# Altium schematic sheet ADC.SchDoc
size OrCAD A
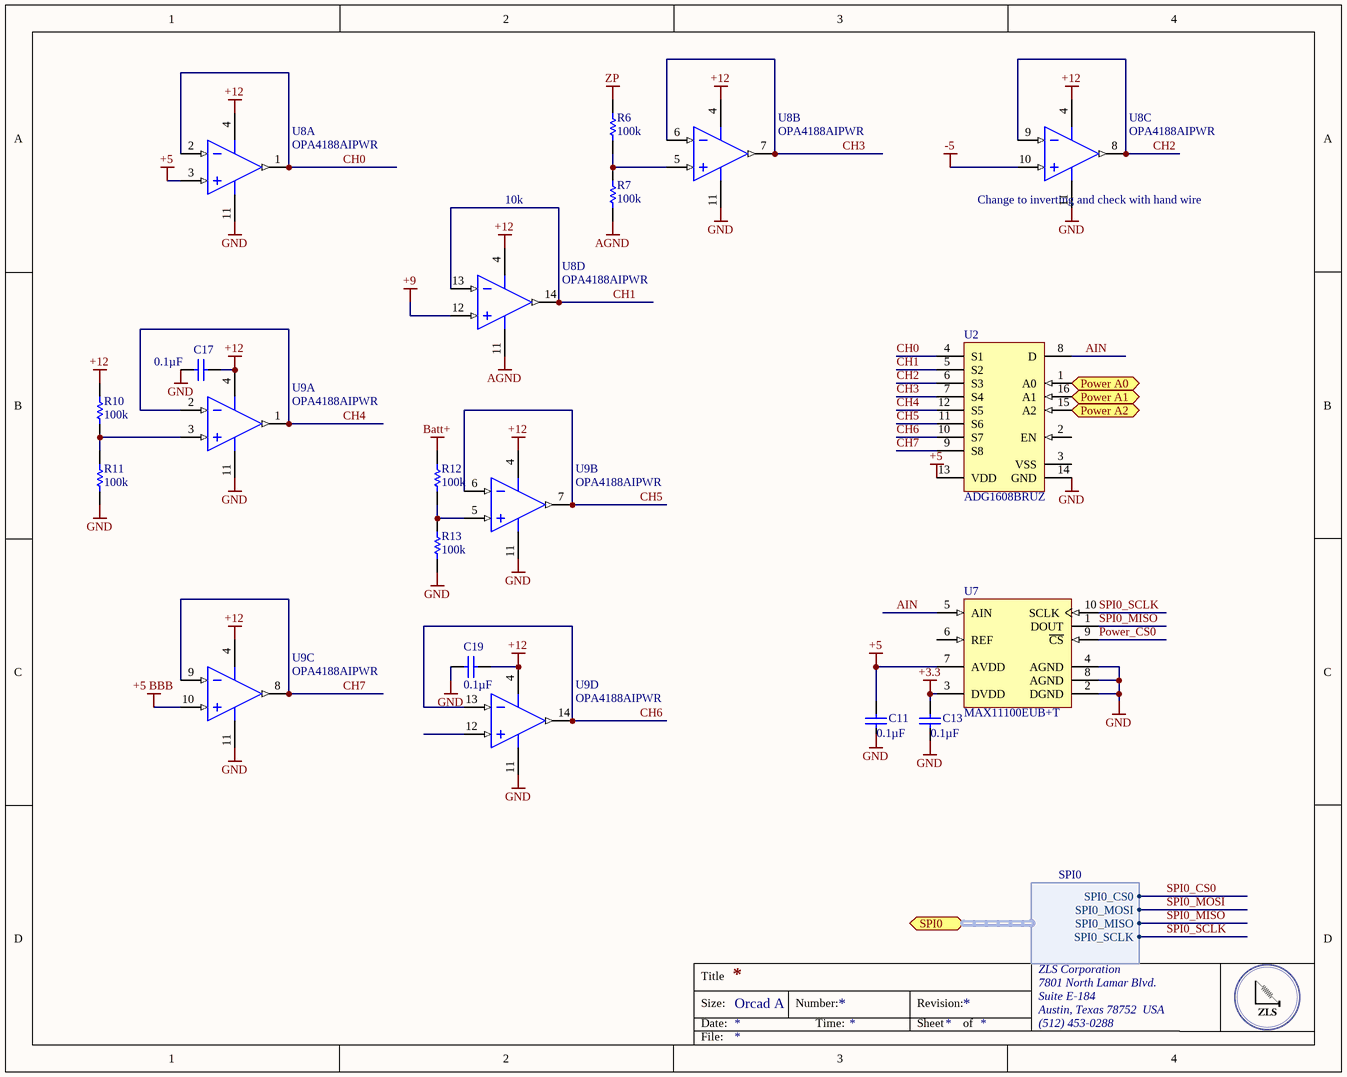
[diagram p0: ADC.SchDoc]

## Parts
C11  Capacitance: 0.1µF  [CAPC0805(2012)145_N]  (hidden comment: CAP CER 0.1UF 25V X7R 0805)
C13  Capacitance: 0.1µF  [CAPC0805(2012)145_N]  (hidden comment: CAP CER 0.1UF 25V X7R 0805)
C17  Capacitance: 0.1µF  [CAPC0805(2012)145_N]  (hidden comment: CAP CER 0.1UF 16V X7R 0805)
C19  Capacitance: 0.1µF  [CAPC0805(2012)145_N]  (hidden comment: CAP CER 0.1UF 16V X7R 0805)
R6  100k  [RESC0402(1005)_M]
R7  100k  [RESC0402(1005)_M]
R10  100k  [RESC0402(1005)_M]
R11  100k  [RESC0402(1005)_M]
R12  100k  [RESC0402(1005)_M]
R13  100k  [RESC0402(1005)_M]
U2  ADG1608BRUZ  [ADI-RU-16_M]
U7  MAX11100EUB+T  [U10+2_L]
U8  OPA4188AIPWR  [PW0014A_N]  (parts A,B,C,D of 4)
U9  OPA4188AIPWR  [PW0014A_N]  (parts A,B,C,D of 4)

## Ports
Power A0, Power A1, Power A2, SPI0 (harness SPI0)

## Harnesses
SPI0: SPI0_CS0, SPI0_MOSI, SPI0_MISO, SPI0_SCLK

## Nets
+3.3: C13.1 U7.3(DVDD)
+5: C11.1 U2.13(VDD) U7.7(AVDD) U8.3(IN_A+)
+5 BBB: U9.10(IN_C+)
+9: U8.12(IN_D+)
+12: C17.2 C19.2 R10.2 U8.4(V+) U9.4(V+)
-5: U8.10(IN_C+)
AGND: R7.1 U8.11(V-)
Batt+: R12.2
GND: C13.2 C17.1 C19.1 R11.1 R13.1 U2.14(GND) U7.2(DGND) U7.4(AGND) U7.8(AGND) U8.11(V-) U9.11(V-)
ZP: R6.2
AIN: U2.8(D) U7.5(AIN)
CH0: U2.4(S1) U8.1(OUT_A) U8.2(IN_A-)
CH1: U2.5(S2) U8.13(IN_D-) U8.14(OUT_D)
CH2: U2.6(S3) U8.8(OUT_C) U8.9(IN_C-)
CH3: U2.7(S4) U8.6(IN_B-) U8.7(OUT_B)
CH4: U2.12(S5) U9.1(OUT_A) U9.2(IN_A-)
CH5: U2.11(S6) U9.6(IN_B-) U9.7(OUT_B)
CH6: U2.10(S7) U9.13(IN_D-) U9.14(OUT_D)
CH7: U2.9(S8) U9.8(OUT_C) U9.9(IN_C-)
Power A0: U2.1(A0) ; port Power A0
Power A1: U2.16(A1) ; port Power A1
Power A2: U2.15(A2) ; port Power A2
Power_CS0: U7.9(~{CS})
SPI0_CS0: port SPI0.SPI0_CS0
SPI0_MISO: U7.1(DOUT) ; port SPI0.SPI0_MISO
SPI0_MOSI: port SPI0.SPI0_MOSI
SPI0_SCLK: U7.10(SCLK) ; port SPI0.SPI0_SCLK
NetR6_1: R6.1 R7.2 U8.5(IN_B+)
NetR10_1: R10.1 R11.2 U9.3(IN_A+)
NetR12_1: R12.1 R13.2 U9.5(IN_B+)

Not connected (* = marked no-connect by the designer): C11 2; U2 2(EN) 3(VSS); U7 6(REF); U9 12(IN_D+)

## Notes on the sheet
- 10k
- (near U8) Change to inverting and check with hand wire
- Labels drawn without touching a wire or pin: GND
- Title
- Size:
- Date:
- Orcad A
- Number:
- Time:
- Revision:
- Sheet
- of
- ZLS Corporation
- 7801 North Lamar Blvd.
- Suite E-184
- Austin, Texas 78752  USA
- (512) 453-0288
- File:

## Library data of the parts
C11 C13 = CMP-1036-04795-1: Manufacturer: Murata Electronics North America; Manufacturer Part Number: GRM21BR71E104KA01L; Tolerance: ±10%; Supplier 1: Digi-Key; Supplier Part Number 1: 490-1673-6-ND; RoHS: RoHS Compliant; Category: Capacitors; Stock 1: 891652; Pricing 1: 1=0.2, 10=0.145, 100=0.0683, 500=0.04788, 1000=0.03964 (USD); Packaging: Digi-Reel®; Part Status: Active; Voltage - Rated: 25V; Temperature Coefficient: X7R; Operating Temperature: -55°C ~ 125°C; Features: -; Ratings: -; Applications: General Purpose; Mounting Type: Surface Mount, MLCC; Package / Case: 0805 (2012 Metric); Size / Dimension: 0.079" L x 0.049" W (2.00mm x 1.25mm); Height - Seated (Max): -; Thickness (Max): 0.053" (1.35mm); Lead Spacing: -; Lead Style: -; ComponentLink1URL: http://www.murata.com/~/media/webrenewal/support/library/catalog/products/capacitor/mlcc/c02e.ashx; ComponentLink1Description: http://www.murata.com/~/media/webrenewal/support/library/catalog/products/capacitor/mlcc/c02e.ashx
C17 C19 = CMP-1036-04795-1: Manufacturer: Murata Electronics North America; Manufacturer Part Number: GRM219R71C104KA01D; Tolerance: ±10%; Voltage - Rated: 25V; Supplier Part Number 1: 490-1673-6-ND; Temperature Coefficient: X7R; Thickness (Max): 0.053" (1.35mm); Supplier 2: Digi-Key; Supplier Part Number 2: 490-1683-6-ND; RoHS: RoHS Compliant; Category: Capacitors; Stock 2: 245331; Pricing 2: 1=0.14, 10=0.098, 100=0.0462, 500=0.0324, 1000=0.02683 (USD); Packaging: Digi-Reel®; Part Status: Active; Operating Temperature: -55°C ~ 125°C; Features: -; Ratings: -; Applications: General Purpose; Mounting Type: Surface Mount, MLCC; Package / Case: 0805 (2012 Metric); Size / Dimension: 0.079" L x 0.049" W (2.00mm x 1.25mm); Height - Seated (Max): -; Lead Spacing: -; Lead Style: -; ComponentLink1URL: http://www.murata.com/~/media/webrenewal/support/library/catalog/products/capacitor/mlcc/c02e.ashx; ComponentLink1Description: http://www.murata.com/~/media/webrenewal/support/library/catalog/products/capacitor/mlcc/c02e.ashx
R6 R7 R10-R13 = CMP-1011-00651-1
U2 = CMP-0793-00136-1: 4.5 Ohm Ron, 8-Channel +/-5 V,+12 V, +5 V and +3.3 V Multiplexer, 16-pin SOP (RU-16), Tube; Manufacturer: Analog Devices; Max Analog Signal Range: 0 to Vdd; Ron (ohms): 4.4; t transition (s): 150n; Bandwidth (Hz): 40M, 40M, 37M, 34M; Code_JEDEC: MO-153AB; PackageReference: RU-16; PackageDescription: 16-Pin Thin Shrink Small Outline Package, Body 5 x 4.4 mm, Pitch 0.65 mm; ComponentLink1Description: Manufacturer URL; ComponentLink2Description: Datasheet; PartNumber: ADG1608BRUZ; Mounting Technology: Surface Mount; PackageVersion: Nov-02; ComponentLink3Description: Package Specification; DatasheetVersion: Rev. 0; Packing: Tube; ComponentLink1URL: http://www.analog.com/en/index.html; ComponentLink3URL: http:/www.analog.com/static/imported-files/packages/36244347913743854010197452789RU16.pdf; ComponentLink2URL: http://www.analog.com/static/imported-files/data_sheets/ADG1608_1609.pdf
U7 = CMP-0249-00017-1: 16-Bit, +5V, 200ksps ADC with 10uA Shutdown, 10-Pin uMAX, -40°C to +85°C, Pb-Free, Tape and Reel; DatasheetVersion: Rev 1, Jan-2012; ComponentLink3URL: http://pdfserv.maxim-ic.com/package_dwgs/21-0061.PDF; PackageReference: U10+2; ComponentLink2URL: http://datasheets.maxim-ic.com/en/ds/MAX11100.pdf; PackageVersion: revL, 2008; ComponentLink1Description: Manufacturer URL; Code_JEDEC: MO-187-BA; ComponentLink1URL: http://www.maxim-ic.com; ComponentLink3Description: Package Specification; PackageDescription: 10-Pin Micro-MAX Thin Shrink Small Outline (uSOP), 3 x 3 x 0.85 mm Body, 0.5 mm Pitch, Pb-Free; ComponentLink2Description: Datasheet
U8 U9 = CMP-0809-00009-2: 0.03 uV/C, Low Noise, Rail-to-Rail Output, Zero-Drift Operational Amplifier, 4 to 36 V, -40 to 125 degC, 14-pin SOP (PW14), Green (RoHS & no Sb/Br); Manufacturer: Texas Instruments; Number of Channels: 4; Iq per channel(Max)(mA): 0.475; CMRR(Min)(dB): 120; GBW(Typ)(MHz): 2; Offset Drift(Typ)(uV/C): 0.03; Total Supply Voltage(Max)(+5V is 5, +/-5V is 10): 36; Rating: Catalog; Slew Rate(Typ)(V/us): 0.8; SubFamily: High Supply Voltage Amplifier (>=30V), Low Noise Amp (<=10nV/rtHz), Low Offset Voltage Amplifier (<=500uV), Low Power Amp (<=500uA), Zero Drift Precision Amplifier; ComponentLink2URL: http://www.ti.com/lit/ds/symlink/opa4188.pdf; PackageReference: PW0014A; ComponentLink3URL: http://www.ti.com/litv/pdf/mpds360; Eco-Plan: Green (RoHS & no Sb/Br); PackageVersion: 4040064-3/G, 02/2011; PartNumber: OPA4188AIPWR; ComponentLink2Description: Datasheet; DatasheetVersion: SBOS641B; Code_JEDEC: MO-153; Mounting Technology: Surface Mount; Total Supply Voltage(Min)(+5V is 5, +/-5V is 10): 4; ComponentLink1URL: http://www.ti.com/; ComponentLink3Description: Package Specification; PackageDescription: 14-Pin Plastic Small Outline, Body 5 x 4.4 mm, Pitch 0.65 mm; ComponentLink1Description: Manufacturer URL; PartId: 1